# Altium schematic sheet POWER.SchDoc
size A4
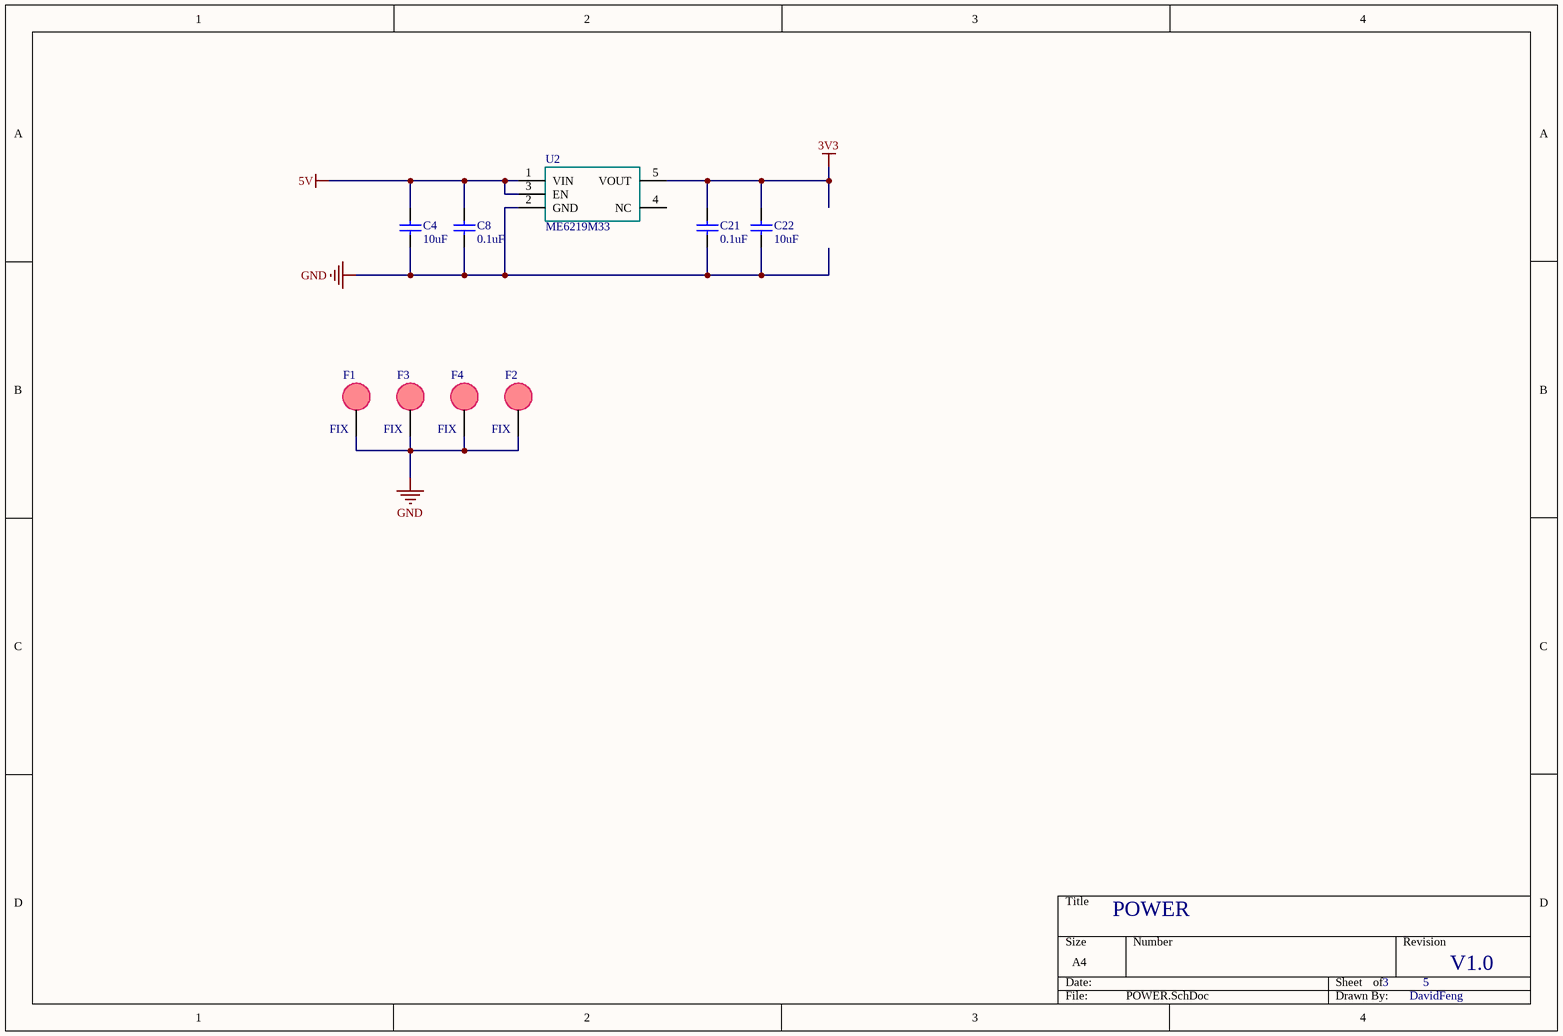
[diagram p0: POWER.SchDoc]

## Parts
C4  10uF  [C0805]
C8  0.1uF  [C0603]
C21  0.1uF  [C0603]
C22  10uF  [C0805]
F1  FIX  [FIX-2.0]
F2  FIX  [FIX-2.0]
F3  FIX  [FIX-2.0]
F4  FIX  [FIX-2.0]
U2  ME6219M33  [SOT23-5]

## Nets
3V3: C21.2 C22.2 U2.5(VOUT)
5V: C4.2 C8.2 U2.1(VIN) U2.3(EN)
GND: C4.1 C8.1 C21.1 C22.1 F1.0 F2.0 F3.0 F4.0 U2.2(GND)

Not connected (* = marked no-connect by the designer): U2 4(NC)

## Notes on the sheet
- POWER
- 3
- 5
- V1.0
- DavidFeng

## Library data of the parts
C4 C8 C21 C22 = Cap: Capacitor; Value: 100pF; Published: 8-Jun-2000; LatestRevisionDate: 17-Jul-2002; LatestRevisionNote: Re-released for DXP Platform.; PackageReference: RAD-0.3; Publisher: Altium Limited
U2 = ME6219: LOW-POWER 100-mA LOW-DROPOUT LINEAR REGULATORS